# Altium schematic sheet Sheet1.SchDoc: Наименование
size 209 x 297 mm; Name: Наименование; ApprovedBy: Утвердил; CheckedBy: Проверил; Author: Разработал; CompanyName: Организация; SheetNumber: 1; SheetTotal: 1; PageSetup: Record=PageOptions|CenterHorizontal=True|CenterVertical=True|PrintScale=0.94|XCorrection=1.00|YCorrection=1.00|PrintKind=1|BorderSize=5000000|LeftOffset=0|BottomOffset=0|Orientation=1|PaperLength=1000|PaperWidth=1000|Scale=100|PaperSource=7|PrintQuality=-4|MediaType=1|DitherType=10|PaperKind=A4|PrintScaleMode=1; DecimalNumber: Децимальный номер; HeadOfSector: Нач. сектора; MainDevice: Перв.примен.; Name1: Наименование1; t_kontr: Т. Контр; n_kontr: Н. Контр; lit_A: О; Name2: Наименование2; DocumentName: Sheet1.SCHDOC
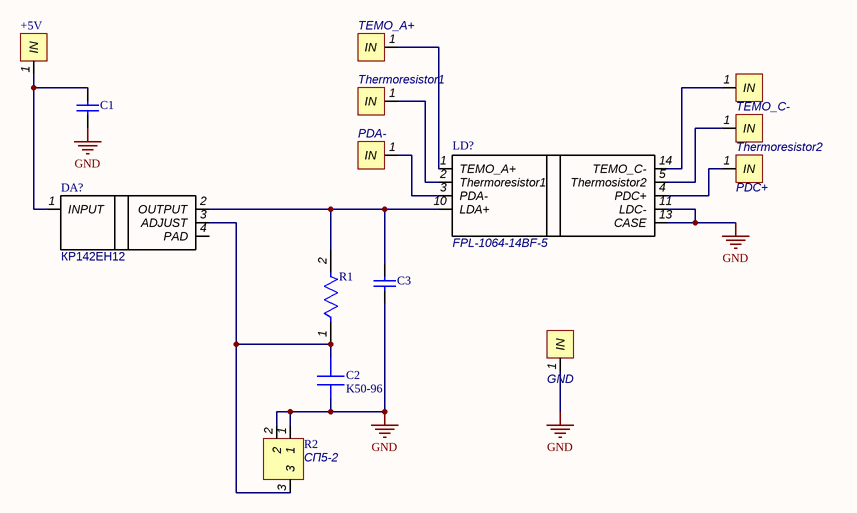
[diagram p0: Sheet1.SchDoc]

## Parts
+5V  +5V  [MGTF_PAD]  (value not drawn)
C1  VJ0805Y105KXQRW1BC  [CAPC2013X145X50NL20T20]  (value not drawn)
C2  K50-96  [КР50-96]
C3  (no value)  [CAPC2220(5750)230_M]
DA?  КР142ЕН12  [КР142ЕН12]
GND  MGTF_PAD  [MGTF_PAD]  (value not drawn)
LD?  FPL-1064-14BF-5  [FPL-1064-14BF-5]
PDA-  MGTF_PAD  [MGTF_PAD]  (value not drawn)
PDC+  MGTF_PAD  [MGTF_PAD]  (value not drawn)
R1  (no value)  [FP-MCU0805-IPC_A]
R2  СП5-2  [СП5-2]
TEMO_A+  MGTF_PAD  [MGTF_PAD]  (value not drawn)
TEMO_C-  MGTF_PAD  [MGTF_PAD]  (value not drawn)
Thermoresistor1  MGTF_PAD  [MGTF_PAD]  (value not drawn)
Thermoresistor2  MGTF_PAD  [MGTF_PAD]  (value not drawn)

## Nets
GND: C1.1 C2.2 C3.1 GND.1(IN) LD?.11(LDC-) LD?.13(CASE) R2.1 R2.2
Net+5V_1: +5V.1(IN) C1.2 DA?.1(INPUT)
NetC2_1: C2.1 DA?.3(ADJUST) R1.1 R2.3
NetC3_2: C3.2 DA?.2(OUTPUT) LD?.10(LDA+) R1.2
NetLD?_1: LD?.1(TEMO_A+) TEMO_A+.1(IN)
NetLD?_2: LD?.2(Thermoresistor1) Thermoresistor1.1(IN)
NetLD?_3: LD?.3(PDA-) PDA-.1(IN)
NetLD?_4: LD?.4(PDC+) PDC+.1(IN)
NetLD?_5: LD?.5(Thermosistor2) Thermoresistor2.1(IN)
NetLD?_14: LD?.14(TEMO_C-) TEMO_C-.1(IN)

Not connected (* = marked no-connect by the designer): DA? 4(PAD)

## Notes on the sheet
- Перв.примен.
- Справ.№
- Подп. и дата
- Инв.№ дубл.
- Взам.инв.№
- Подп.и дата
- Разраб.
- Изм.
- Лист
- № докум.
- Подп.
- Дата
- Лит.
- Масштаб
- Масса
- Т.контр.
- Пров.
- СХЕМА   ЭЛЕКТРИЧЕСКАЯ
- ПРИНЦИПИАЛЬНАЯ
- Листов
- Инв.№ подл.
- Утв.
- Н.контр.
- Нач.сект.

## Library data of the parts
+5V = MGTF_PAD
C1 = CMP-2007-01676-1: Manufacturer: Vitramon; Part Number: VJ0805Y105KXQRW1BC
C3 = CMP-1042-00301-2: CAP 10nF 200V ±5% 2220 (5750 Metric) Thickness 2.3mm SMD; Case-Metric: 5750; Case-EIA: 2220; Tolerance: Â±5%; Max Thickness: 2.3 mm; Rated Voltage: 200 V; Value: 10nF; Technology: SMT
R1 = CMP-02407-001292-1: RES 1.05K OHM 0.5% 1/5W 0805; Temperature Coefficient: 25ppm/°C; Resistance: 100R; Power Rating: 200mW; Tolerance: 0.1%; Voltage Rating: 150V; Packaging: Tape and Reel; Width: 0.049inch; Height: 0.024inch; Features: Automotive AEC-Q200; Weight: 0.000162oz; Max Operating Temperature: 155°C; Case Code (Metric): 2012; Case Code (Imperial): 0805; Composition: Thin Film; Package Quantity: 1; Number of Terminations: 2; Length: 0.079inch; Min Operating Temperature: -55°C; Max Power Dissipation: 200mW; Case/Package: 0805